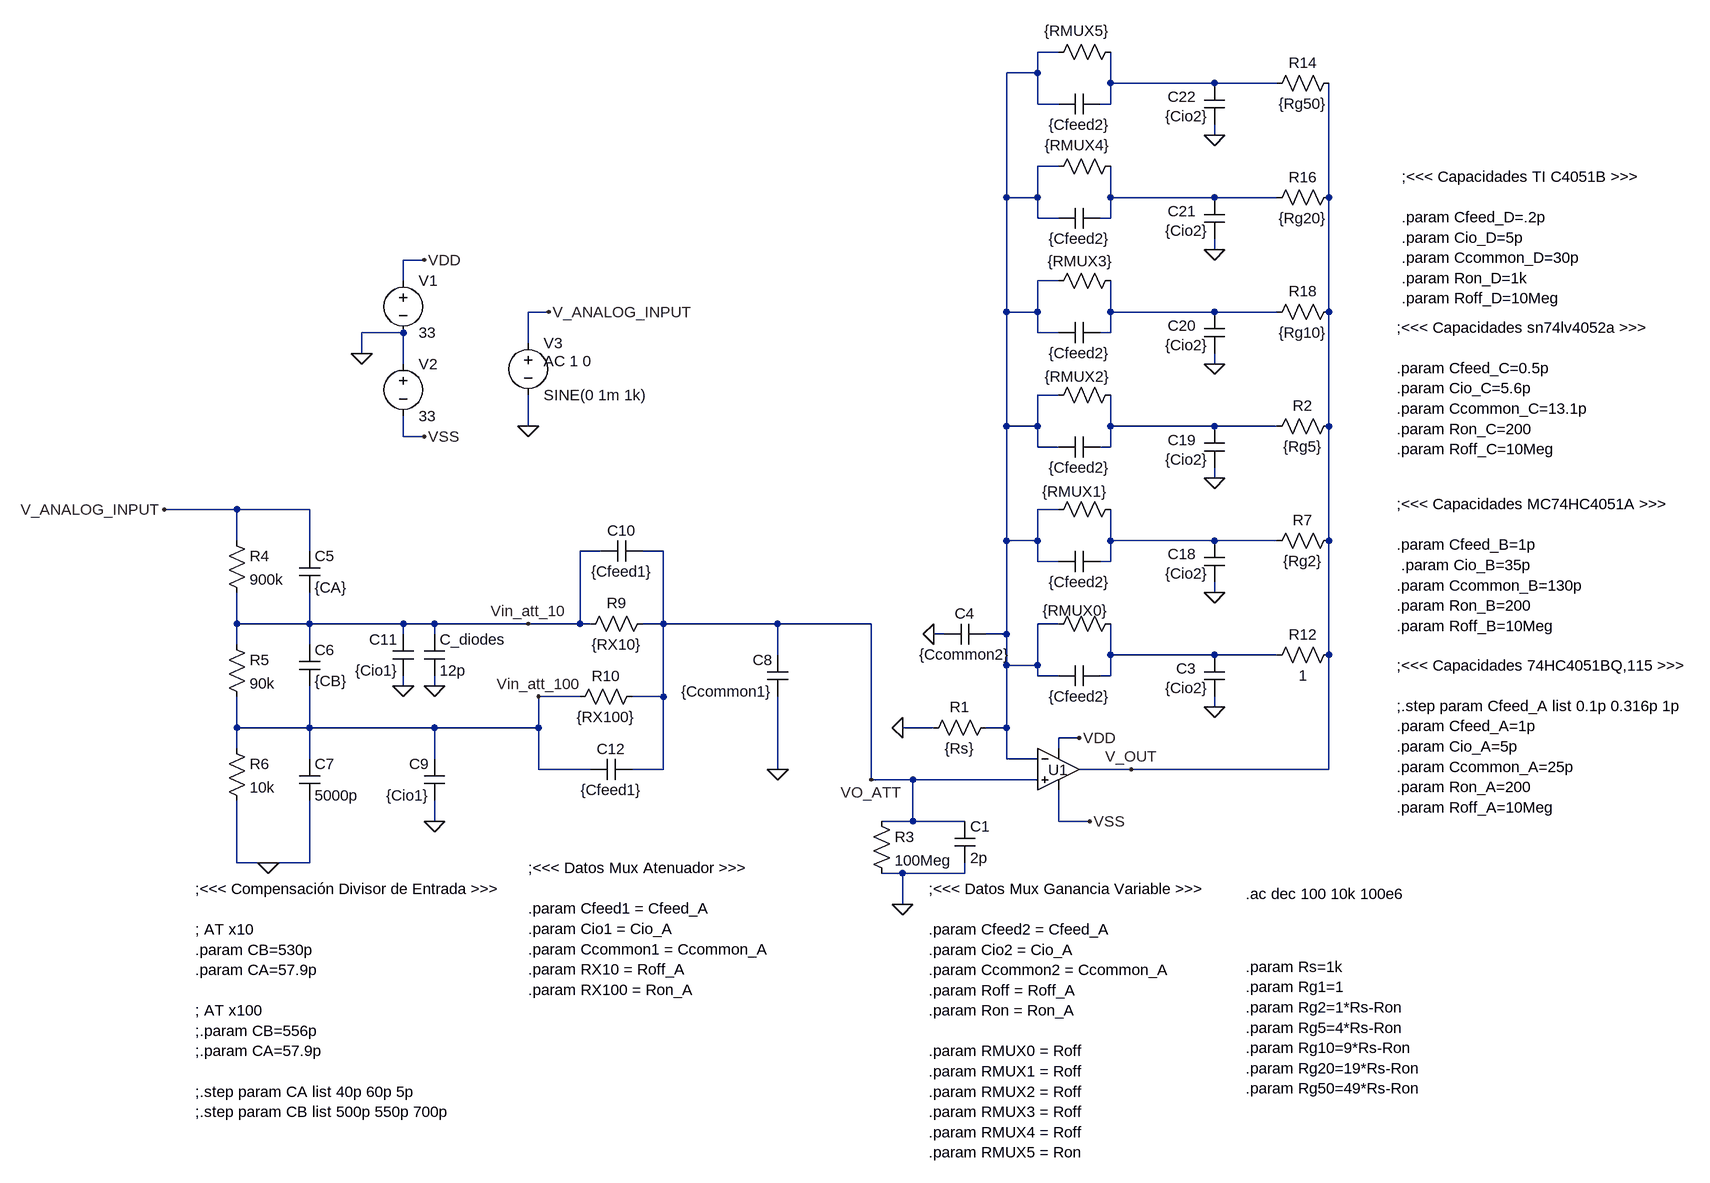
[diagram p0: schematic mux_sim_A.asc]
mux_sim_A.asc, the LTspice schematic file:
Version 4
SHEET 1 1052 1400
WIRE -32 -544 -64 -544
WIRE -64 -512 -64 -544
WIRE -64 -512 -112 -512
WIRE 48 -496 48 -544
WIRE 208 -496 48 -496
WIRE 304 -496 208 -496
WIRE -64 -464 -64 -512
WIRE -32 -464 -64 -464
WIRE 48 -464 48 -496
WIRE 48 -464 32 -464
WIRE 208 -416 208 -432
WIRE -32 -368 -64 -368
WIRE -112 -320 -112 -512
WIRE -64 -320 -64 -368
WIRE -64 -320 -112 -320
WIRE 48 -320 48 -368
WIRE 208 -320 48 -320
WIRE 304 -320 208 -320
WIRE 384 -320 384 -496
WIRE -64 -288 -64 -320
WIRE -32 -288 -64 -288
WIRE 48 -288 48 -320
WIRE 48 -288 32 -288
WIRE 208 -240 208 -256
WIRE -1008 -224 -1040 -224
WIRE -1040 -192 -1040 -224
WIRE -32 -192 -64 -192
WIRE -816 -144 -848 -144
WIRE -112 -144 -112 -320
WIRE -64 -144 -64 -192
WIRE -64 -144 -112 -144
WIRE 48 -144 48 -192
WIRE 208 -144 48 -144
WIRE 304 -144 208 -144
WIRE 384 -144 384 -320
WIRE -1040 -112 -1104 -112
WIRE -64 -112 -64 -144
WIRE -32 -112 -64 -112
WIRE 48 -112 48 -144
WIRE 48 -112 32 -112
WIRE -848 -96 -848 -144
WIRE -1104 -80 -1104 -112
WIRE -1040 -64 -1040 -112
WIRE 208 -64 208 -80
WIRE -32 -16 -64 -16
WIRE -848 32 -848 -16
WIRE -112 32 -112 -144
WIRE -64 32 -64 -16
WIRE -64 32 -112 32
WIRE 48 32 48 -16
WIRE 208 32 48 32
WIRE 304 32 208 32
WIRE 384 32 384 -144
WIRE -1040 48 -1040 16
WIRE -1008 48 -1040 48
WIRE -64 64 -64 32
WIRE -32 64 -64 64
WIRE 48 64 48 32
WIRE 48 64 32 64
WIRE 208 112 208 96
WIRE -1296 160 -1408 160
WIRE -1184 160 -1296 160
WIRE -32 160 -64 160
WIRE -1296 208 -1296 160
WIRE -112 208 -112 32
WIRE -64 208 -64 160
WIRE -64 208 -112 208
WIRE 48 208 48 160
WIRE 208 208 48 208
WIRE 304 208 208 208
WIRE 384 208 384 32
WIRE -1184 224 -1184 160
WIRE -736 224 -768 224
WIRE -640 224 -672 224
WIRE -64 240 -64 208
WIRE -32 240 -64 240
WIRE 48 240 48 208
WIRE 48 240 32 240
WIRE 208 288 208 272
WIRE -1296 336 -1296 288
WIRE -1184 336 -1184 288
WIRE -1184 336 -1296 336
WIRE -1040 336 -1184 336
WIRE -992 336 -1040 336
WIRE -848 336 -992 336
WIRE -768 336 -768 224
WIRE -768 336 -848 336
WIRE -752 336 -768 336
WIRE -640 336 -640 224
WIRE -640 336 -672 336
WIRE -464 336 -640 336
WIRE -320 336 -464 336
WIRE -32 336 -64 336
WIRE -1040 352 -1040 336
WIRE -992 352 -992 336
WIRE -208 352 -224 352
WIRE -112 352 -112 208
WIRE -112 352 -144 352
WIRE -1296 368 -1296 336
WIRE -1184 368 -1184 336
WIRE -464 384 -464 336
WIRE 48 384 48 336
WIRE 208 384 48 384
WIRE 304 384 208 384
WIRE 384 384 384 208
WIRE -112 400 -112 352
WIRE -64 400 -64 336
WIRE -64 400 -112 400
WIRE -64 416 -64 400
WIRE -32 416 -64 416
WIRE 48 416 48 384
WIRE 48 416 32 416
WIRE -1040 432 -1040 416
WIRE -992 432 -992 416
WIRE -768 448 -832 448
WIRE -640 448 -640 336
WIRE -640 448 -688 448
WIRE 208 464 208 448
WIRE -1296 496 -1296 448
WIRE -1184 496 -1184 432
WIRE -1184 496 -1296 496
WIRE -992 496 -1184 496
WIRE -832 496 -832 448
WIRE -832 496 -992 496
WIRE -224 496 -272 496
WIRE -112 496 -112 400
WIRE -112 496 -144 496
WIRE 0 512 -32 512
WIRE -1296 528 -1296 496
WIRE -32 528 -32 512
WIRE -1184 544 -1184 496
WIRE -992 544 -992 496
WIRE -112 544 -112 496
WIRE -64 544 -112 544
WIRE -832 560 -832 496
WIRE -752 560 -832 560
WIRE -640 560 -640 448
WIRE -640 560 -688 560
WIRE -464 560 -464 448
WIRE 80 560 0 560
WIRE 384 560 384 384
WIRE 384 560 80 560
WIRE -320 576 -320 336
WIRE -256 576 -320 576
WIRE -64 576 -256 576
WIRE -992 640 -992 608
WIRE -256 640 -256 576
WIRE -256 640 -304 640
WIRE -176 640 -256 640
WIRE -32 640 -32 592
WIRE 16 640 -32 640
WIRE -1296 704 -1296 608
WIRE -1248 704 -1296 704
WIRE -1184 704 -1184 608
WIRE -1184 704 -1248 704
WIRE -272 720 -304 720
WIRE -176 720 -176 704
WIRE -176 720 -272 720
WIRE -272 768 -272 720
FLAG 16 640 VSS
FLAG -272 768 0
FLAG -272 496 0
FLAG 0 512 VDD
FLAG -1104 -80 0
FLAG -1008 -224 VDD
FLAG -1008 48 VSS
FLAG -816 -144 V_ANALOG_INPUT
FLAG -848 32 0
FLAG 80 560 V_OUT
FLAG -224 352 0
FLAG 208 464 0
FLAG -1248 704 0
FLAG -1408 160 V_ANALOG_INPUT
FLAG -464 560 0
FLAG -1040 432 0
FLAG -848 336 Vin_att_10
FLAG -832 448 Vin_att_100
FLAG -992 640 0
FLAG -320 576 VO_ATT
FLAG -992 432 0
FLAG 208 288 0
FLAG 208 112 0
FLAG 208 -64 0
FLAG 208 -240 0
FLAG 208 -416 0
SYMBOL res -240 512 R270
WINDOW 0 32 56 VTop 2
WINDOW 3 0 56 VBottom 2
SYMATTR InstName R1
SYMATTR Value {Rs}
SYMBOL res 400 16 R90
WINDOW 0 0 56 VBottom 2
WINDOW 3 32 56 VTop 2
SYMATTR InstName R2
SYMATTR Value {Rg5}
SYMBOL cap -192 640 R0
SYMATTR InstName C1
SYMATTR Value 2p
SYMBOL res -320 624 R0
SYMATTR InstName R3
SYMATTR Value 100Meg
SYMBOL voltage -1040 -208 R0
WINDOW 123 0 0 Left 2
WINDOW 39 0 0 Left 2
SYMATTR InstName V1
SYMATTR Value 33
SYMBOL voltage -1040 -80 R0
WINDOW 123 0 0 Left 2
WINDOW 39 0 0 Left 2
SYMATTR InstName V2
SYMATTR Value 33
SYMBOL voltage -848 -112 R0
WINDOW 123 24 44 Left 2
WINDOW 39 0 0 Left 2
SYMATTR Value2 AC 1 0
SYMATTR InstName V3
SYMATTR Value SINE(0 1m 1k)
SYMBOL Opamps\\UniversalOpamp2 -32 560 R0
WINDOW 0 -16 1 Left 2
SYMATTR InstName U1
SYMATTR Value2 Avol=1Meg GBW=250Meg Slew=100Meg
SYMBOL cap 32 48 R90
WINDOW 0 0 32 Invisible 2
WINDOW 3 32 32 VTop 2
SYMATTR InstName C2
SYMATTR Value {Cfeed2}
SYMBOL cap -144 336 R90
WINDOW 0 0 32 VBottom 2
WINDOW 3 32 32 VTop 2
SYMATTR InstName C4
SYMATTR Value {Ccommon2}
SYMBOL cap 224 448 R180
WINDOW 0 44 43 Left 2
WINDOW 3 26 13 Left 2
SYMATTR InstName C3
SYMATTR Value {Cio2}
SYMBOL res -1312 192 R0
SYMATTR InstName R4
SYMATTR Value 900k
SYMBOL res -1312 352 R0
SYMATTR InstName R5
SYMATTR Value 90k
SYMBOL res -1312 512 R0
SYMATTR InstName R6
SYMATTR Value 10k
SYMBOL cap -1200 224 R0
SYMATTR InstName C5
SYMATTR Value {CA}
SYMBOL cap -1200 368 R0
SYMATTR InstName C6
SYMATTR Value {CB}
SYMBOL cap -1200 544 R0
SYMATTR InstName C7
SYMATTR Value 5000p
SYMBOL res 64 -32 R90
WINDOW 0 0 56 Invisible 2
WINDOW 3 -28 67 VTop 2
SYMATTR InstName R8
SYMATTR Value {RMUX2}
SYMBOL cap -448 448 R180
WINDOW 0 24 56 Left 2
WINDOW 3 24 8 Left 2
SYMATTR InstName C8
SYMATTR Value {Ccommon1}
SYMBOL cap -672 208 R90
WINDOW 0 0 32 VBottom 2
WINDOW 3 32 32 VTop 2
SYMATTR InstName C10
SYMATTR Value {Cfeed1}
SYMBOL cap -1024 416 R180
WINDOW 0 24 56 Left 2
WINDOW 3 24 8 Left 2
SYMATTR InstName C11
SYMATTR Value {Cio1}
SYMBOL cap -976 608 R180
WINDOW 0 24 56 Left 2
WINDOW 3 24 8 Left 2
SYMATTR InstName C9
SYMATTR Value {Cio1}
SYMBOL res -656 320 R90
WINDOW 0 0 56 VBottom 2
WINDOW 3 32 56 VTop 2
SYMATTR InstName R9
SYMATTR Value {RX10}
SYMBOL res -672 432 R90
WINDOW 0 0 56 VBottom 2
WINDOW 3 32 56 VTop 2
SYMATTR InstName R10
SYMATTR Value {RX100}
SYMBOL cap -688 544 R90
WINDOW 0 0 32 VBottom 2
WINDOW 3 32 32 VTop 2
SYMATTR InstName C12
SYMATTR Value {Cfeed1}
SYMBOL res 400 192 R90
WINDOW 0 0 56 VBottom 2
WINDOW 3 32 56 VTop 2
SYMATTR InstName R7
SYMATTR Value {Rg2}
SYMBOL cap 32 224 R90
WINDOW 0 0 32 Invisible 2
WINDOW 3 32 32 VTop 2
SYMATTR InstName C13
SYMATTR Value {Cfeed2}
SYMBOL res 64 144 R90
WINDOW 0 0 56 Invisible 2
WINDOW 3 -27 71 VTop 2
SYMATTR InstName R11
SYMATTR Value {RMUX1}
SYMBOL res 400 368 R90
WINDOW 0 0 56 VBottom 2
WINDOW 3 32 56 VTop 2
SYMATTR InstName R12
SYMATTR Value 1
SYMBOL cap 32 400 R90
WINDOW 0 0 32 Invisible 2
WINDOW 3 32 32 VTop 2
SYMATTR InstName C14
SYMATTR Value {Cfeed2}
SYMBOL res 64 320 R90
WINDOW 0 0 56 Invisible 2
WINDOW 3 -20 70 VTop 2
SYMATTR InstName R13
SYMATTR Value {RMUX0}
SYMBOL res 400 -512 R90
WINDOW 0 0 56 VBottom 2
WINDOW 3 32 56 VTop 2
SYMATTR InstName R14
SYMATTR Value {Rg50}
SYMBOL cap 32 -480 R90
WINDOW 0 0 32 Invisible 2
WINDOW 3 32 32 VTop 2
SYMATTR InstName C15
SYMATTR Value {Cfeed2}
SYMBOL res 64 -560 R90
WINDOW 0 0 56 Invisible 2
WINDOW 3 -32 68 VTop 2
SYMATTR InstName R15
SYMATTR Value {RMUX5}
SYMBOL res 400 -336 R90
WINDOW 0 0 56 VBottom 2
WINDOW 3 32 56 VTop 2
SYMATTR InstName R16
SYMATTR Value {Rg20}
SYMBOL cap 32 -304 R90
WINDOW 0 0 32 Invisible 2
WINDOW 3 32 32 VTop 2
SYMATTR InstName C16
SYMATTR Value {Cfeed2}
SYMBOL res 64 -384 R90
WINDOW 0 0 56 Invisible 2
WINDOW 3 -32 67 VTop 2
SYMATTR InstName R17
SYMATTR Value {RMUX4}
SYMBOL res 400 -160 R90
WINDOW 0 0 56 VBottom 2
WINDOW 3 32 56 VTop 2
SYMATTR InstName R18
SYMATTR Value {Rg10}
SYMBOL cap 32 -128 R90
WINDOW 0 0 32 Invisible 2
WINDOW 3 32 32 VTop 2
SYMATTR InstName C17
SYMATTR Value {Cfeed2}
SYMBOL res 64 -208 R90
WINDOW 0 0 56 Invisible 2
WINDOW 3 -30 62 VTop 2
SYMATTR InstName R19
SYMATTR Value {RMUX3}
SYMBOL cap -1008 352 R0
SYMATTR InstName C_diodes
SYMATTR Value 12p
SYMBOL cap 224 272 R180
WINDOW 0 44 43 Left 2
WINDOW 3 26 13 Left 2
SYMATTR InstName C18
SYMATTR Value {Cio2}
SYMBOL cap 224 96 R180
WINDOW 0 44 43 Left 2
WINDOW 3 26 13 Left 2
SYMATTR InstName C19
SYMATTR Value {Cio2}
SYMBOL cap 224 -80 R180
WINDOW 0 44 43 Left 2
WINDOW 3 26 13 Left 2
SYMATTR InstName C20
SYMATTR Value {Cio2}
SYMBOL cap 224 -256 R180
WINDOW 0 44 43 Left 2
WINDOW 3 26 13 Left 2
SYMATTR InstName C21
SYMATTR Value {Cio2}
SYMBOL cap 224 -432 R180
WINDOW 0 44 43 Left 2
WINDOW 3 26 13 Left 2
SYMATTR InstName C22
SYMATTR Value {Cio2}
TEXT 488 -120 Left 2 !;<<< Capacidades sn74lv4052a >>>\n \n.param Cfeed_C=0.5p\n.param Cio_C=5.6p\n.param Ccommon_C=13.1p\n.param Ron_C=200\n.param Roff_C=10Meg
TEXT -1360 744 Left 2 !;<<< Compensación Divisor de Entrada >>>\n \n; AT x10 \n.param CB=530p\n.param CA=57.9p\n \n; AT x100\n;.param CB=556p\n;.param CA=57.9p\n \n;.step param CA list 40p 60p 5p\n;.step param CB list 500p 550p 700p
TEXT -848 712 Left 2 !;<<< Datos Mux Atenuador >>>\n \n.param Cfeed1 = Cfeed_A\n.param Cio1 = Cio_A\n.param Ccommon1 = Ccommon_A\n.param RX10 = Roff_A\n.param RX100 = Ron_A
TEXT 488 152 Left 2 !;<<< Capacidades MC74HC4051A >>>\n \n.param Cfeed_B=1p\n .param Cio_B=35p\n.param Ccommon_B=130p\n.param Ron_B=200\n.param Roff_B=10Meg
TEXT -232 744 Left 2 !;<<< Datos Mux Ganancia Variable >>>\n \n.param Cfeed2 = Cfeed_A\n.param Cio2 = Cio_A\n.param Ccommon2 = Ccommon_A\n.param Roff = Roff_A\n.param Ron = Ron_A\n \n.param RMUX0 = Roff\n.param RMUX1 = Roff\n.param RMUX2 = Roff\n.param RMUX3 = Roff\n.param RMUX4 = Roff\n.param RMUX5 = Ron
TEXT 256 752 Left 2 !.ac dec 100 10k 100e6
TEXT 488 400 Left 2 !;<<< Capacidades 74HC4051BQ,115 >>>\n \n;.step param Cfeed_A list 0.1p 0.316p 1p\n.param Cfeed_A=1p\n.param Cio_A=5p\n.param Ccommon_A=25p\n.param Ron_A=200\n.param Roff_A=10Meg
TEXT 496 -352 Left 2 !;<<< Capacidades TI C4051B >>>\n \n.param Cfeed_D=.2p\n.param Cio_D=5p\n.param Ccommon_D=30p\n.param Ron_D=1k\n.param Roff_D=10Meg
TEXT 256 864 Left 2 !.param Rs=1k\n.param Rg1=1\n.param Rg2=1*Rs-Ron\n.param Rg5=4*Rs-Ron\n.param Rg10=9*Rs-Ron\n.param Rg20=19*Rs-Ron\n.param Rg50=49*Rs-Ron

The netlist it stands for:
* mux_sim_A.asc
R1 0 N001 {Rs}
R2 V_OUT N005 {Rg5}
C1 VO_ATT 0 2p
R3 VO_ATT 0 100Meg
V1 VDD 0 33
V2 0 VSS 33
V3 V_ANALOG_INPUT 0 SINE(0 1m 1k) AC 1 0
XU1 VO_ATT N001 VDD VSS V_OUT level.2 Avol=1Meg GBW=250Meg Slew=100Meg ilimit=25m rail=0 Vos=0 phimargin=45 en=0 enk=0 in=0 ink=0 Rin=500Meg  ; pins IN+ IN- V+ V- OUT
C2 N005 N001 {Cfeed2}
C4 N001 0 {Ccommon2}
C3 0 N007 {Cio2}
R4 V_ANALOG_INPUT Vin_att_10 900k
R5 Vin_att_10 Vin_att_100 90k
R6 Vin_att_100 0 10k
C5 V_ANALOG_INPUT Vin_att_10 {CA}
C6 Vin_att_10 Vin_att_100 {CB}
C7 Vin_att_100 0 5000p
R8 N005 N001 {RMUX2}
C8 0 VO_ATT {Ccommon1}
C10 VO_ATT Vin_att_10 {Cfeed1}
C11 0 Vin_att_10 {Cio1}
C9 0 Vin_att_100 {Cio1}
R9 VO_ATT Vin_att_10 {RX10}
R10 VO_ATT Vin_att_100 {RX100}
C12 VO_ATT Vin_att_100 {Cfeed1}
R7 V_OUT N006 {Rg2}
C13 N006 N001 {Cfeed2}
R11 N006 N001 {RMUX1}
R12 V_OUT N007 1
C14 N007 N001 {Cfeed2}
R13 N007 N001 {RMUX0}
R14 V_OUT N002 {Rg50}
C15 N002 N001 {Cfeed2}
R15 N002 N001 {RMUX5}
R16 V_OUT N003 {Rg20}
C16 N003 N001 {Cfeed2}
R17 N003 N001 {RMUX4}
R18 V_OUT N004 {Rg10}
C17 N004 N001 {Cfeed2}
R19 N004 N001 {RMUX3}
C_diodes Vin_att_10 0 12p
C18 0 N006 {Cio2}
C19 0 N005 {Cio2}
C20 0 N004 {Cio2}
C21 0 N003 {Cio2}
C22 0 N002 {Cio2}
;<<< Capacidades sn74lv4052a >>>
.param Cfeed_C=0.5p
.param Cio_C=5.6p
.param Ccommon_C=13.1p
.param Ron_C=200
.param Roff_C=10Meg
;<<< Compensación Divisor de Entrada >>>
; AT x10
.param CB=530p
.param CA=57.9p
; AT x100
;.param CB=556p
;.param CA=57.9p
;.step param CA list 40p 60p 5p
;.step param CB list 500p 550p 700p
;<<< Datos Mux Atenuador >>>
.param Cfeed1 = Cfeed_A
.param Cio1 = Cio_A
.param Ccommon1 = Ccommon_A
.param RX10 = Roff_A
.param RX100 = Ron_A
;<<< Capacidades MC74HC4051A >>>
.param Cfeed_B=1p
 .param Cio_B=35p
.param Ccommon_B=130p
.param Ron_B=200
.param Roff_B=10Meg
;<<< Datos Mux Ganancia Variable >>>
.param Cfeed2 = Cfeed_A
.param Cio2 = Cio_A
.param Ccommon2 = Ccommon_A
.param Roff = Roff_A
.param Ron = Ron_A
.param RMUX0 = Roff
.param RMUX1 = Roff
.param RMUX2 = Roff
.param RMUX3 = Roff
.param RMUX4 = Roff
.param RMUX5 = Ron
.ac dec 100 10k 100e6
;<<< Capacidades 74HC4051BQ,115 >>>
;.step param Cfeed_A list 0.1p 0.316p 1p
.param Cfeed_A=1p
.param Cio_A=5p
.param Ccommon_A=25p
.param Ron_A=200
.param Roff_A=10Meg
;<<< Capacidades TI C4051B >>>
.param Cfeed_D=.2p
.param Cio_D=5p
.param Ccommon_D=30p
.param Ron_D=1k
.param Roff_D=10Meg
.param Rs=1k
.param Rg1=1
.param Rg2=1*Rs-Ron
.param Rg5=4*Rs-Ron
.param Rg10=9*Rs-Ron
.param Rg20=19*Rs-Ron
.param Rg50=49*Rs-Ron
.lib UniversalOpamps2.sub
.backanno
.end